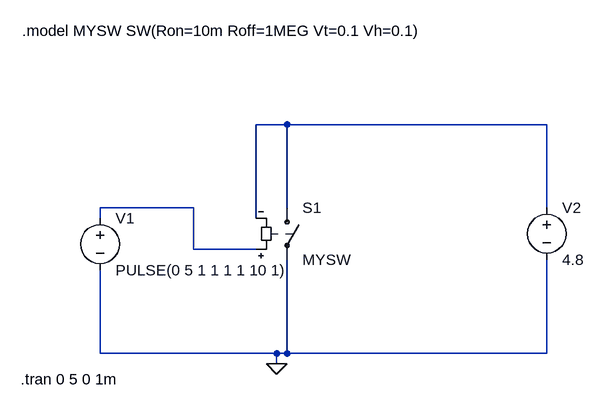
[diagram p0: schematic test-switch-hysteres.asc]
test-switch-hysteres.asc, the LTspice schematic file:
Version 4
SHEET 1 928 680
WIRE 464 240 416 240
WIRE 864 240 464 240
WIRE 320 368 176 368
WIRE 464 368 464 240
WIRE 864 368 864 240
WIRE 176 384 176 368
WIRE 416 384 416 240
WIRE 320 432 320 368
WIRE 416 432 320 432
WIRE 176 592 176 464
WIRE 448 592 176 592
WIRE 464 592 464 448
WIRE 464 592 448 592
WIRE 864 592 864 448
WIRE 864 592 464 592
WIRE 448 608 448 592
FLAG 448 608 0
SYMBOL sw 464 352 R0
SYMATTR InstName S1
SYMATTR Value MYSW
SYMBOL voltage 864 352 R0
WINDOW 123 0 0 Left 0
WINDOW 39 0 0 Left 0
SYMATTR InstName V2
SYMATTR Value 4.8
SYMBOL voltage 176 368 R0
WINDOW 123 0 0 Left 0
WINDOW 39 0 0 Left 0
SYMATTR InstName V1
SYMATTR Value PULSE(0 5 1 1 1 1 10 1)
TEXT 56 96 Left 2 !.model MYSW SW(Ron=10m Roff=1MEG Vt=0.1 Vh=0.1)
TEXT 54 632 Left 2 !.tran 0 5 0 1m

The netlist it stands for:
* test-switch-hysteres.asc
S1 N001 0 N002 N001 MYSW
V2 N001 0 4.8
V1 N002 0 PULSE(0 5 1 1 1 1 10 1)
.model MYSW SW(Ron=10m Roff=1MEG Vt=0.1 Vh=0.1)
.tran 0 5 0 1m
.backanno
.end